# Altium schematic sheet M7_DSP_Power_Supply.SchDoc
size A3; SheetNumber: 3; SheetTotal: 5
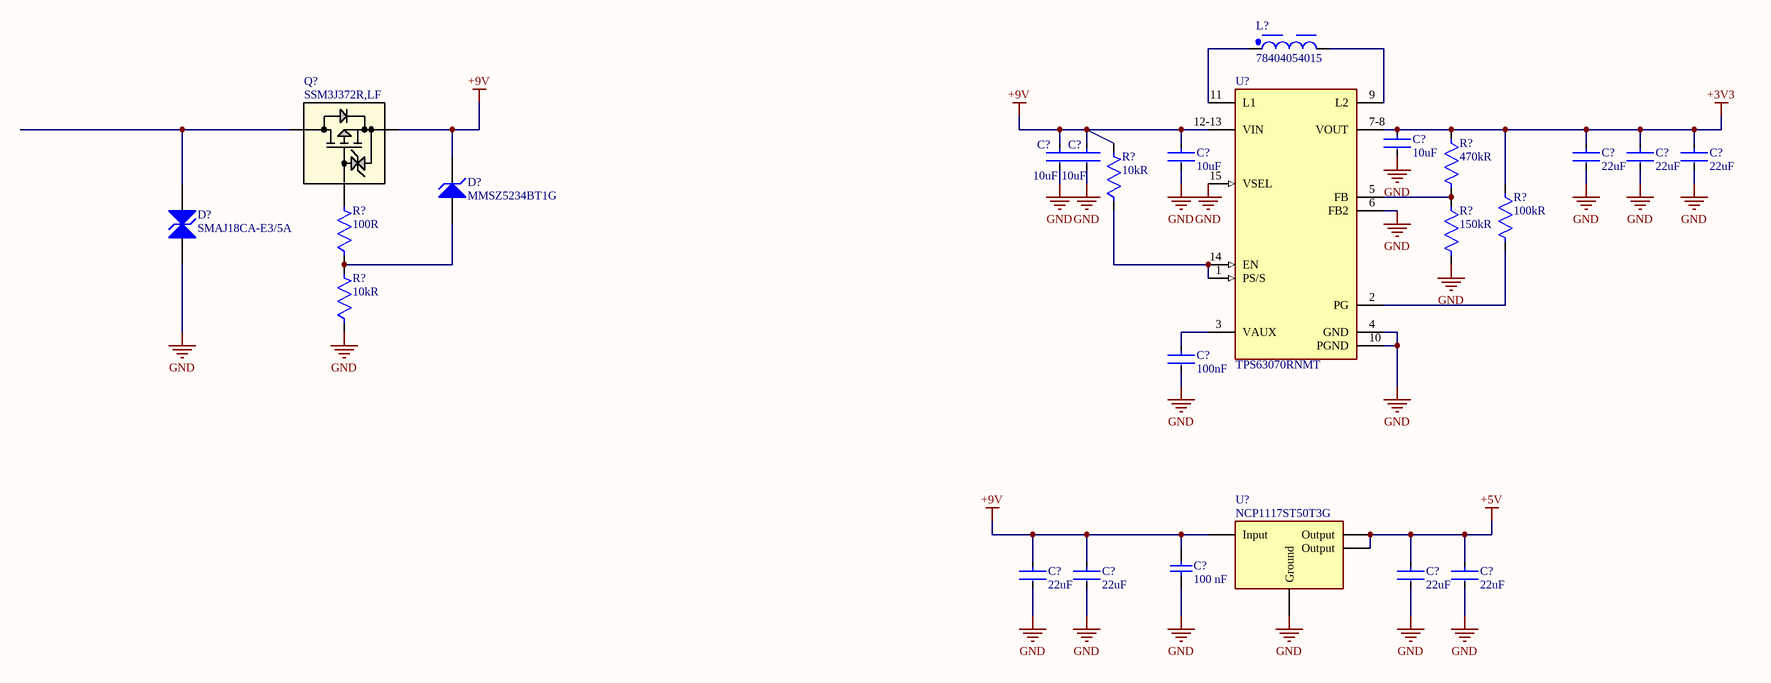
[diagram p0: M7_DSP_Power_Supply.SchDoc]

## Parts
(Parts that share a designator on the sheet are numbered #1, #2 ... from top to bottom, then left to right.)
C?#1  Capacitance: 10uF  [FP-0603-L_1_6_0_2-W_0_8_0-MFG]  (hidden comment: TMK107BBJ106MA-T)
C?#2  value 10uF  [FP-GRM21B-0_2-e0_2_0_7-MFG]  (hidden comment: GRM21BC71E106ME11L)
C?#3  value 10uF  [FP-GRM21B-0_2-e0_2_0_7-MFG]  (hidden comment: GRM21BC71E106ME11L)
C?#4  Capacitance: 10uF  [FP-0603-L_1_6_0_2-W_0_8_0-MFG]  (hidden comment: TMK107BBJ106MA-T)
C?#5  Capacitance: 22uF  [FP-GRM21B-0_2-e0_2_0_7-MFG]  (hidden comment: GRM21BC81C226ME44L)
C?#6  Capacitance: 22uF  [FP-GRM21B-0_2-e0_2_0_7-MFG]  (hidden comment: GRM21BC81C226ME44L)
C?#7  Capacitance: 22uF  [FP-GRM21B-0_2-e0_2_0_7-MFG]  (hidden comment: GRM21BC81C226ME44L)
C?#8  Capacitance: 100nF  [FP-0402-L_1_0_0_05-W_0_5-MFG]  (hidden comment: TMK105B7104MV-FR)
C?#9  Capacitance: 100 nF  [CAPC1608X90X40ML10T20]  (hidden comment: CC0603ZRY5V9BB104)
C?#10  Capacitance: 22uF  [FP-GRM21B-0_2-e0_2_0_7-MFG]  (hidden comment: GRM21BC81C226ME44L)
C?#11  Capacitance: 22uF  [FP-GRM21B-0_2-e0_2_0_7-MFG]  (hidden comment: GRM21BC81C226ME44L)
C?#12  Capacitance: 22uF  [FP-GRM21B-0_2-e0_2_0_7-MFG]  (hidden comment: GRM21BC81C226ME44L)
C?#13  Capacitance: 22uF  [FP-GRM21B-0_2-e0_2_0_7-MFG]  (hidden comment: GRM21BC81C226ME44L)
D?#1  MMSZ5234BT1G  [ONSC-SOD-123-2-425-04_V]
D?#2  SMAJ18CA-E3/5A  [VISH-DO-214AC-2_L]
L?  78404054015  [WE-LQSA_5040]
Q?  SSM3J372R,LF  [SOT-23F_TOS]
R?#1  Resistance: 470kR  [FP-AC0603-MFG]  (hidden comment: AC0603FR-07470KL)
R?#2  Resistance: 100kR  [FP-AC0603-MFG]  (hidden comment: AC0603FR-07100KL)
R?#3  Resistance: 150kR  [FP-AC0603-MFG]  (hidden comment: AC0603FR-07150KL)
R?#4  Resistance: 10kR  [FP-AC0603-MFG]  (hidden comment: AC0603FR-0710KL)
R?#5  Resistance: 100R  [FP-AC0603-MFG]  (hidden comment: AC0603FR-07100RL)
R?#6  Resistance: 10kR  [FP-AC0603-MFG]  (hidden comment: AC0603FR-0710KL)
U?#1  TPS63070RNMT  [FP-RNM0015A-MFG]
U?#2  NCP1117ST50T3G  [FP-318H-MFG]

## Nets
+3V3: C?#1.1 C?#5.1 C?#6.1 C?#7.1 R?#1.1 R?#2.1 U?#1.7-8(VOUT)
+5V: C?#12.1 C?#13.1 U?#2.2(Output) U?#2.4(Output)
+9V: C?#2.1 C?#3.1 C?#4.1 C?#9.1 C?#10.1 C?#11.1 D?#1.1(K) Q?.2 R?#4.2 U?#1.12-13(VIN) U?#2.3(Input)
GND: C?#1.2 C?#2.2 C?#3.2 C?#4.2 C?#5.2 C?#6.2 C?#7.2 C?#8.2 C?#9.2 C?#10.2 C?#11.2 C?#12.2 C?#13.2 D?#2.1(A1) R?#3.2 R?#6.1 U?#1.4(GND) U?#1.6(FB2) U?#1.10(PGND) U?#1.15(VSEL) U?#2.1(Ground)
NetC?#8_1: C?#8.1 U?#1.3(VAUX)
NetD?#1_2: D?#1.2(A) R?#5.1 R?#6.2
NetD?#2_2: D?#2.2(A2) Q?.3
NetL?_1: L?.1 U?#1.11(L1)
NetL?_2: L?.2 U?#1.9(L2)
NetQ?_1: Q?.1 R?#5.2
NetR?#1_2: R?#1.2 R?#3.1 U?#1.5(FB)
NetR?#2_2: R?#2.2 U?#1.2(PG)
NetR?#4_1: R?#4.1 U?#1.1(PS/S) U?#1.14(EN)

## Library data of the parts
C?#1 C?#4 = CMP-14477-005164-2: Multilayer Ceramic Capacitor 10uF 25V X5R 20% SMD 0603 T/R; Packaging: Tape and Reel; Tolerance: 20%; Mount: Surface Mount; Case Code (Metric): 1608; Case Code (Imperial): 0603; Min Operating Temperature: -55°C; Lead Free: Lead Free; RoHS Compliant: Yes; Case/Package: 0603; Max Operating Temperature: 85°C; Voltage Rating: 25V; Supplier 1: Rs; Supplier Part Number 1: 1782887
C?#2 C?#3 = GRM21BC71E106ME11L: Multilayer Ceramic Capacitors MLCC - SMD/SMT 0805 10uF 25volts *Derate Voltage/Temp; Manufacturer: Murata; Voltage Rating: 25V; Tolerance: 20%; Dielectric: X7S; Manufacturer Part Number: GRM21BC71E106ME11L; RoHS: Yes; Category: Ceramic Capacitors; Stock 1: 6000; Pricing 1: 3000=0.1097, 9000=0.0994, 24000=0.097, 45000=0.0923 (USD); Mounting Technology: Surface Mount; Case/Package: 0805; Case Code (Metric): 2012; Case Code (Imperial): 0805; Weight: 0.000335oz; Min Operating Temperature: -55°C; Max Operating Temperature: 125°C; Packaging: Tape and Reel; Termination: SMD/SMT; Voltage Rating (DC): 25V; Package Quantity: 3000; Series: GRM; Length: 0.079inch; Width: 0.049inch; Height: 1.25mm; Thickness: 0.057inch; RoHS Compliant: Yes; ComponentLink1URL: http://www.mouser.com/ds/2/281/c02e-2905.pdf?src-supplier=Mouser; ComponentLink1Description: http://www.mouser.com/ds/2/281/c02e-2905.pdf?src-supplier=Mouser; ComponentLink2URL: http://search.murata.co.jp/Ceramy/image/img/A01X/G101/ENG/GRM21BC71E106ME11-01.pdf?src-supplier=Digikey; ComponentLink2Description: http://search.murata.co.jp/Ceramy/image/img/A01X/G101/ENG/GRM21BC71E106ME11-01.pdf?src-supplier=Digikey; ComponentLink3URL: http://search.murata.co.jp/Ceramy/image/img/A01X/partnumbering_e_01.pdf?src-supplier=Digikey; ComponentLink3Description: http://search.murata.co.jp/Ceramy/image/img/A01X/partnumbering_e_01.pdf?src-supplier=Digikey; ComponentLink4URL: https://datasheet.octopart.com/GRM21BC71E106ME11L-Murata-datasheet-149523451.pdf?src-supplier=Newark; ComponentLink4Description: https://datasheet.octopart.com/GRM21BC71E106ME11L-Murata-datasheet-149523451.pdf?src-supplier=Newark; ComponentLink5URL: https://datasheet.octopart.com/GRM21BC71E106ME11L-Murata-datasheet-32479577.pdf?src-supplier=Future+Electronics; ComponentLink5Description: https://datasheet.octopart.com/GRM21BC71E106ME11L-Murata-datasheet-32479577.pdf?src-supplier=Future+Electronics; Supplier Part Number 1: GRM21BC71E106ME11L; Supplier 1: Arrow Electronics
C?#5-C?#7 C?#10-C?#13 = CMP-06035-012913-1: Chip Multilayer Ceramic Capacitors for General Purpose, 0805, 22uF, X6S, 22%, 20%, 16V; Packaging: Tape and Reel; Dielectric: X6S; Case Code (Imperial): 0805; Weight: 0.000335oz; Case Code (Metric): 2012; Thickness: 0.057inch; Min Operating Temperature: -55°C; Voltage Rating (DC): 16V; Tolerance: 20%; Width: 1.25mm; Voltage Rating: 16V; Mount: Surface Mount; Length: 0.079inch; Lead Free: Lead Free; Case/Package: 0805; Package Quantity: 3000; Height: 1.25mm; Max Operating Temperature: 105°C; Termination: SMD/SMT; Supplier 1: Rs; Supplier Part Number 1: 2478094
C?#8 = CMP-14477-003834-2: Multilayer Ceramic Capacitors (High dielectric type), 25V, 0.1 uF, ± 20 %, 0402, X7R, RoHS; Manufacturer: Taiyo Yuden; Tolerance: 20%; Value: 100nF; Min Operating Temperature: -55°C; Voltage Rating: 25V; Max Operating Temperature: 125°C; Mount: Surface Mount; RoHS Compliant: Yes; Case/Package: 0402; Packaging: Tape and Reel; Supplier 1: Avnet; Manufacturer Part Number: TMK105B7104MV-FR; RoHS: Yes; Category: Ceramic Capacitors; Stock 1: 20000; Pricing 1: 10000=0.00533, 20000=0.00524, 40000=0.00515, 60000=0.00506, 80000=0.00497 (USD); Mounting Technology: Surface Mount; Series: M; ComponentLink1URL: http://ds.yuden.co.jp/TYCOMPAS/ut/detail.do?productNo=TMK105B7104MV-FR&amp;fileName=TMK105B7104MV-FR_SS&amp;mode=specSheetDownload&src-supplier=Digikey; ComponentLink1Description: http://ds.yuden.co.jp/TYCOMPAS/ut/detail.do?productNo=TMK105B7104MV-FR&amp;fileName=TMK105B7104MV-FR_SS&amp;mode=specSheetDownload&src-supplier=Digikey; Supplier Part Number 1: TMK105B7104MV-FR
C?#9 = CMP-1035-02594-2: Chip Capacitor, 100 nF, - 20% to + 80%, 50 V, -30 to 85 degC, 0603 (1608 Metric), RoHS, Tape and Reel; Manufacturer: Yageo; Tolerance: -20%,+80%; Product Training Modules: MultilayerCeramicCapacitors; Temperature Coefficient: Y5V(F); Kits: CC060300000000000-ND-MLCC0603SAMPLEKIT; Other Names: 311-1343-1; Featured Product: CommodityMultilayerCeramicCapacitors–CCSeries; Online Catalog: CCSeries; Voltage - Rated: 50V; Mounting Type: SurfaceMount,MLCC; Package Description: 2-Pin Surface Mount Device, Body 1.6 x 0.8 mm; Ratings: -; Lead Spacing: -; Standard Package: 1; Applications: GeneralPurpose; Size / Dimension: 0.063"Lx0.031"W(1.60mmx0.80mm); Package Reference: 0603; Operating Temperature: -30°C~85°C; Features: -; Height - Seated (Max): -; Thickness (Max): 0.035"(0.90mm); Series: CC; Datasheet URL: https://datasheet.ciiva.com/17434/upy-gphc-y5v-6-3v-to-50v-5-17434523.pdf; Family: CeramicCapacitors; Mounting Technology: SurfaceMount; Packaging: CutTape(CT); Package / Case: 0603(1608Metric); Manufacturer URL: http://www.yageo.com/; Category: Capacitors; Lead Style: -; Datasheet Version: Rev. 5, 07/2010; Supplier 1: Rs; Supplier Part Number 1: 6169565
D?#1 = CMP-1060-00589-1: Zener Voltage Regulator, 500 mW, 2-Pin SOD-123, Pb-Free, Tape and Reel; Manufacturer: On Semiconductor; P Max (W): 0.5; VZ Typ (V): 6.2; ComponentLink3Description: Package Specification; PartNumber: MMSZ5234BT1G; ComponentLink2Description: Datasheet; Packing: Tape and Reel; Mounting Technology: Surface Mount; ComponentLink3URL: http://www.onsemi.com/pub_link/Collateral/425-04.PDF; DatasheetVersion: Rev. 12; ComponentLink1Description: Manufacturer URL; PackageDescription: 2-Pin SOD, Body 1.6 x 2.69 mm; PackageVersion: Rev. G, 10/2009; ComponentLink2URL: http://www.onsemi.com/pub_link/Collateral/MMSZ5221BT1-D.PDF; RoHS: Pb-Free; ComponentLink1URL: http://www.onsemi.com/; PackageReference: SOD-123-2-425-04; Supplier 1: Future Electronics; Supplier Part Number 1: 5159872
D?#2 = CMP-0548-00266-2: Transient Voltage Suppressor, 6.40 to 231 V, 18 V Stand-off Voltage, Bi-Directional, -55 to 155 degC, 2-pin DO-214AC, Pb-Free, Tape and Reel; Manufacturer: Vishay Semiconductor; VWM (V): 18; VBR Bi-Directional (V): 6.4 to 231; ID (uA): 2; IFSM: 40 A; PPPM (W): 400, 300; ComponentLink1URL: http://www.vishay.com/; PackageDescription: 2-Pin DO-214AC (SMA), Body 4.245 x 2.665 mm; ComponentLink2URL: http://www.vishay.com/docs/88390/smaj50a.pdf; Packing: Tape and Reel; DatasheetVersion: 12/8/2013; RoHS: TRUE; ComponentLink2Description: Datasheet; Mounting Technology: Surface Mount; PackageReference: DO-214AC-2; PartNumber: SMAJ18CA-E3/5A; ComponentLink1Description: Manufacturer URL; Operating Junction and Storage Temperature Range: -55 to 150 degC; ComponentLink3Description: Package Specification; ComponentLink3URL: http://www.vishay.com/docs/88390/smaj50a.pdf; Supplier 1: Mouser; Supplier Part Number 1: 625-SMAJ18CA-E3/5A
L? = CMP-03913-130031011-1: 78404054015 Power Inductor, Smd, 1.5Uh, 5.22A Rohs Compliant: Yes |Wurth Elektronik 78404054015; DC Resistance (DCR): 15mΩ; Inductance: 1.5µH; Voltage Rating: 80V; Height: 4mm; Current Rating: 5.22A; RoHS: Compliant; Width: 5mm; NexarPartId: 130031011; Max Operating Temperature: 150°C; Ambient Temperature Range High: 100°C; Length: 5mm; Min Operating Temperature: -50°C; Ambient Temperature Range Low: -50°C; Supplier 1: Rs; Supplier Part Number 1: 2591077P
Q? = SSM3J372R,LF: Mosfet P-ch 30V 6A SOT23F; Mfr_Name: Toshiba Electronic Devices & Storage Corp.; Manufacturer: Toshiba; Type: DEV; Copyright: Copyright (C) 2024 Ultra Librarian. All rights reserved.; Manufacturer_Part_Number: SSM3J372R,LF; RefDes: RefDes; Supplier 1: Mouser; Manufacturer Part Number: SSM3J372R,LF; RoHS: No; Stock 1: 871; Pricing 1: 1=0.3873, 10=0.294, 25=0.2912, 100=0.1497, 250=0.1482, 500=0.0889 (USD); Supplier Part Number 1: 757-SSM3J372RLF
R?#1 = CMP-03412-003482-2: RES 470KΩ 1.00% 0.1W 0603; Voltage Rating: 50V; Max Power Dissipation: 100mW; Tolerance: 1%; Temperature Coefficient: 100ppm/°C; RoHS Compliant: Yes; Width: 0.8mm; Military Standard: Not; Number of Terminations: 2; Case/Package: 0603; Min Operating Temperature: -55°C; Length: 1.6mm; Construction: Rectangular; Power Rating: 100mW; Ratings: AEC-Q200; Height: 0.45mm; Packaging: Tape and Reel; Case Code (Imperial): 0603; Case Code (Metric): 1608; Termination: SMD/SMT; Max Operating Temperature: 155°C; Features: Moisture Resistant; Series: AC; Depth: 0.8mm; Resistor Type: Thick Film; Supplier 1: Future Electronics; Supplier Part Number 1: 7097719
R?#2 = CMP-2000-04816-3: RES 100KΩ 1.00% 0.1W 0603; Temperature Coefficient: 100ppm/°C; Voltage Rating: 50V; Max Power Dissipation: 100mW; Tolerance: 1%; Working Voltage: 75V; Min Operating Temperature: -55°C; Case Code (Imperial): 0603; Width: 0.031inch; Max Operating Temperature: 155°C; Military Standard: Not; Technology: THICK FILM; Ratings: AEC-Q200; Features: Moisture Resistant; Construction: Rectangular; Resistor Type: Thick Film; RoHS Compliant: Yes; Case Code (Metric): 1608; Termination: SMD/SMT; Series: AC; Lead Free: Lead Free; Length: 1.6mm; Depth: 0.8mm; Height: 0.022inch; Power Rating: 100mW; Package Quantity: 1; Packaging: Tape and Reel; Case/Package: 0603; Number of Terminations: 2; Moisture Sensitivity Level: 1; Supplier 1: Future Electronics; Supplier Part Number 1: 6029288
R?#3 = CMP-03412-018794-2: RES 150KΩ 1.00% 0.1W 0603; Power Rating: 100mW; Voltage Rating: 50V; Tolerance: 1%; Temperature Coefficient: 100ppm/°C; Ratings: AEC-Q200; Resistor Type: Thick Film; Series: AC; Termination: SMD/SMT; Width: 0.8mm; Weight: 7.1E-05oz; Height: 0.45mm; Min Operating Temperature: -55°C; Number of Terminations: 2; RoHS Compliant: Yes; Length: 1.6mm; Case Code (Metric): 1608; Features: Moisture Resistant; Max Power Dissipation: 100mW; Case Code (Imperial): 0603; Case/Package: 0603; Max Operating Temperature: 155°C; Packaging: Tape and Reel; Supplier 1: Future Electronics; Supplier Part Number 1: 5095701
R?#4 R?#6 = CMP-2000-04818-3: RES 10KΩ 1.00% 0.1W 0603; Power Rating: 100mW; Tolerance: 1%; Voltage Rating: 50V; Temperature Coefficient: 100ppm/°C; Ratings: AEC-Q200; Case Code (Metric): 1608; Max Power Dissipation: 100mW; Height: 0.45mm; Package Quantity: 1; Max Operating Temperature: 155°C; Resistor Type: Thick Film; Depth: 0.8mm; RoHS Compliant: Yes; Min Operating Temperature: -55°C; Packaging: Tape and Reel; Number of Terminations: 2; Length: 1.6mm; Features: Moisture Resistant; Military Standard: Not; Case Code (Imperial): 0603; Size Code: 0603; Termination: SMD/SMT; Case/Package: 0603; Mount: Surface Mount; Width: 0.8mm; Lead Free: Lead Free; Series: AC; Construction: Rectangular; Supplier 1: Future Electronics; Supplier Part Number 1: 2029400
R?#5 = CMP-2000-04817-3: RES 100Ω 1.00% 0.1W 0603; Temperature Coefficient: 100ppm/°C; Voltage Rating: 50V; Max Power Dissipation: 100mW; Tolerance: 1%; Series: AC; Height: 0.45mm; Max Operating Temperature: 155°C; Depth: 0.8mm; Lead Free: Lead Free; Packaging: Tape and Reel; Min Operating Temperature: -55°C; Number of Terminations: 2; Length: 1.6mm; RoHS Compliant: Yes; Contact Plating: Tin; Construction: Rectangular; Radiation Hardening: No; Width: 0.8mm; Power Rating: 100mW; Ratings: AEC-Q200; Termination: SMD/SMT; Resistor Type: Thick Film; Weight: 7.1E-05oz; Case Code (Metric): 1608; Military Standard: Not; Case Code (Imperial): 0603; Size Code: 0603; Features: Moisture Resistant; Case/Package: 0603; Supplier 1: Future Electronics; Supplier Part Number 1: 2026405
U?#1 = CMP-04918-000001-1: IC REG BCK BST ADJ 2A 15VQFN; Manufacturer: Texas Instruments; Number Of Outputs: 1; Max Duty Cycle: 100%; Output Type: AdjustableProgrammable; Max Supply Voltage: 16V; Max Junction Temp: +125°C; Switching Topology: Buck-Boost; Output Voltage: 2.5-9V; Standoff Height: 0mm; Min Supply Voltage: 2V; Switching Frequency: 2400kHz; Nominal Supply Current: 5-54uA; Temperature: -40°C to +125°C; Manufacturer Part Number: TPS63070RNMT; Device Class L1: Integrated Circuits (ICs); RoHS: TRUE; Package: RNM0015A; Octopart: https://octopart.com/tps63070rnmt-texas+instruments-75117739; Output Current: 2A; Device Class L3: Voltage Regulators - Switching; Temperature Range High: +125°C; ComponentLink2Description: Datasheet; ComponentLink2URL: http://www.ti.com/lit/ds/symlink/tps63070.pdf; Lead Free: Yes; Device Class L2: Power Management ICs; Automotive: No; Height: 1mm; Temperature Range Low: -40°C; Category: IC; Digikey Description: IC REG BCK BST ADJ 2A 15VQFN; Supplier 1: Mouser; Supplier Part Number 1: 595-TPS63070RNMT
U?#2 = CMP-0592-00001-4: IC REG LINEAR 5V 1A SOT223; Output Voltage Accuracy: 1%; Number of Outputs: 1; Dropout Voltage: 1.2V; Polarity: Positive; Power Rating: 781mW; Input Bias Current: 6mA; Quiescent Current: 10mA; Output Type: Fixed; Max Input Voltage: 20V; Min Input Voltage: 3.5V; Max Operating Temperature: 125°C; Number of Pins: 4; Case/Package: SOT-223; Min Operating Temperature: 0°C; Accuracy: 1%; Contact Plating: Tin; Min Current Limit: 1A; Output Current: 1A; Max Output Current: 1A; Length: 6.7mm; Packaging: Tape and Reel; Package Quantity: 1; Height: 1.69mm; REACH SVHC: No SVHC; Width: 3.7mm; Halogen Free: Halogen Free; RoHS Compliant: Yes; Nominal Output Voltage: 5V; Lead Free: Lead Free; Radiation Hardening: No; Tolerance: 1%; Number of Regulators: 1; Output Voltage: 5V; Supplier 1: Digikey; Supplier Part Number 1: NCP1117ST50T3GOSCT-ND